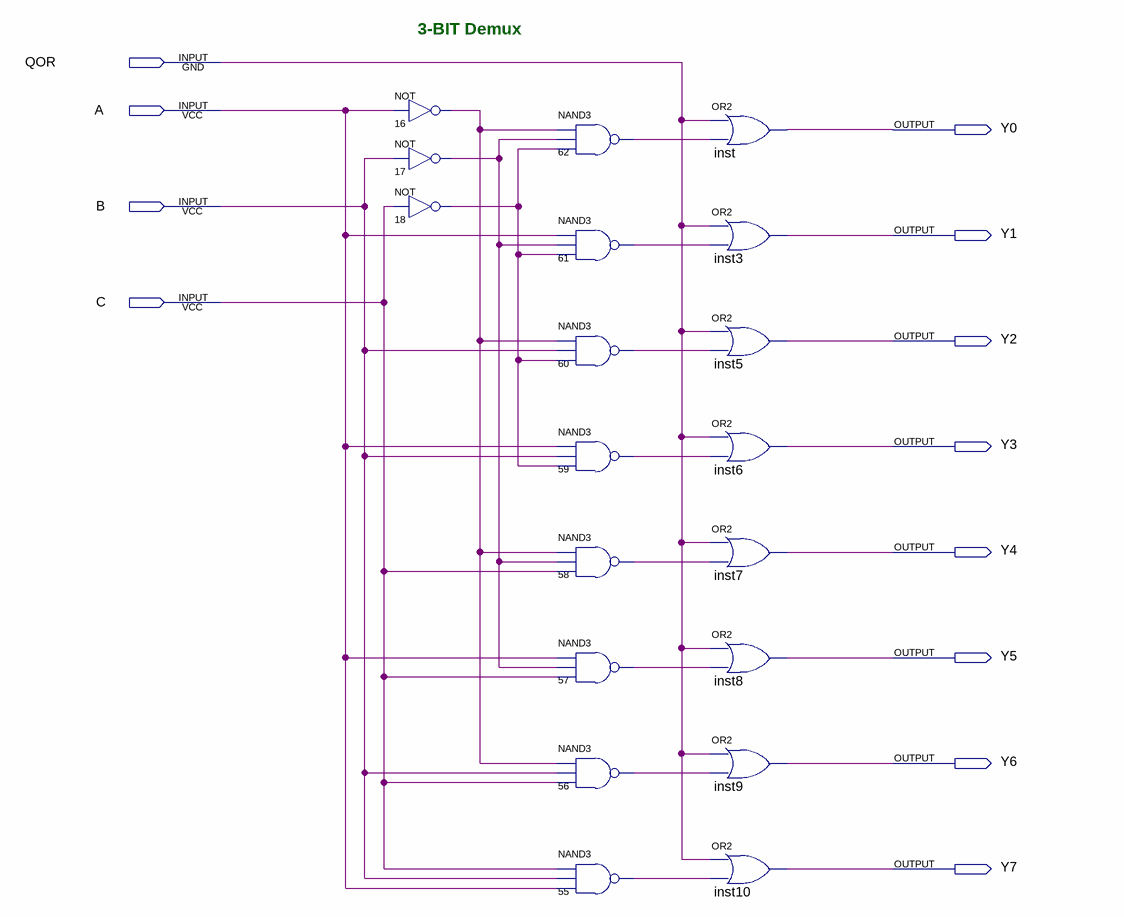
[diagram p0: schematic sheet]
// Quartus schematic 3demux.bdf as structural Verilog: 19 symbols, 12 pins
module \3demux  (
  input  QOR,
  input  A,
  input  B,
  input  C,
  output Y0,
  output Y1,
  output Y2,
  output Y3,
  output Y4,
  output Y5,
  output Y6,
  output Y7
);

  wire n16_out, n17_out, n18_out, n55_out, n56_out, n57_out, n58_out, n59_out, n60_out, n61_out, n62_out;

  not u_16 (n16_out, A);
  not u_17 (n17_out, B);
  not u_18 (n18_out, C);
  nand u_62 (n62_out, n16_out, n17_out, n18_out);
  nand u_61 (n61_out, A, n17_out, n18_out);
  nand u_60 (n60_out, n16_out, B, n18_out);
  nand u_59 (n59_out, A, B, n18_out);
  nand u_58 (n58_out, n16_out, n17_out, C);
  nand u_57 (n57_out, A, n17_out, C);
  nand u_56 (n56_out, n16_out, B, C);
  nand u_55 (n55_out, C, B, A);
  or inst (Y0, QOR, n62_out);
  or inst3 (Y1, QOR, n61_out);
  or inst5 (Y2, QOR, n60_out);
  or inst6 (Y3, QOR, n59_out);
  or inst7 (Y4, QOR, n58_out);
  or inst8 (Y5, QOR, n57_out);
  or inst9 (Y6, QOR, n56_out);
  or inst10 (Y7, QOR, n55_out);

  // Notes on the sheet:
  //   3-BIT Demux
endmodule
